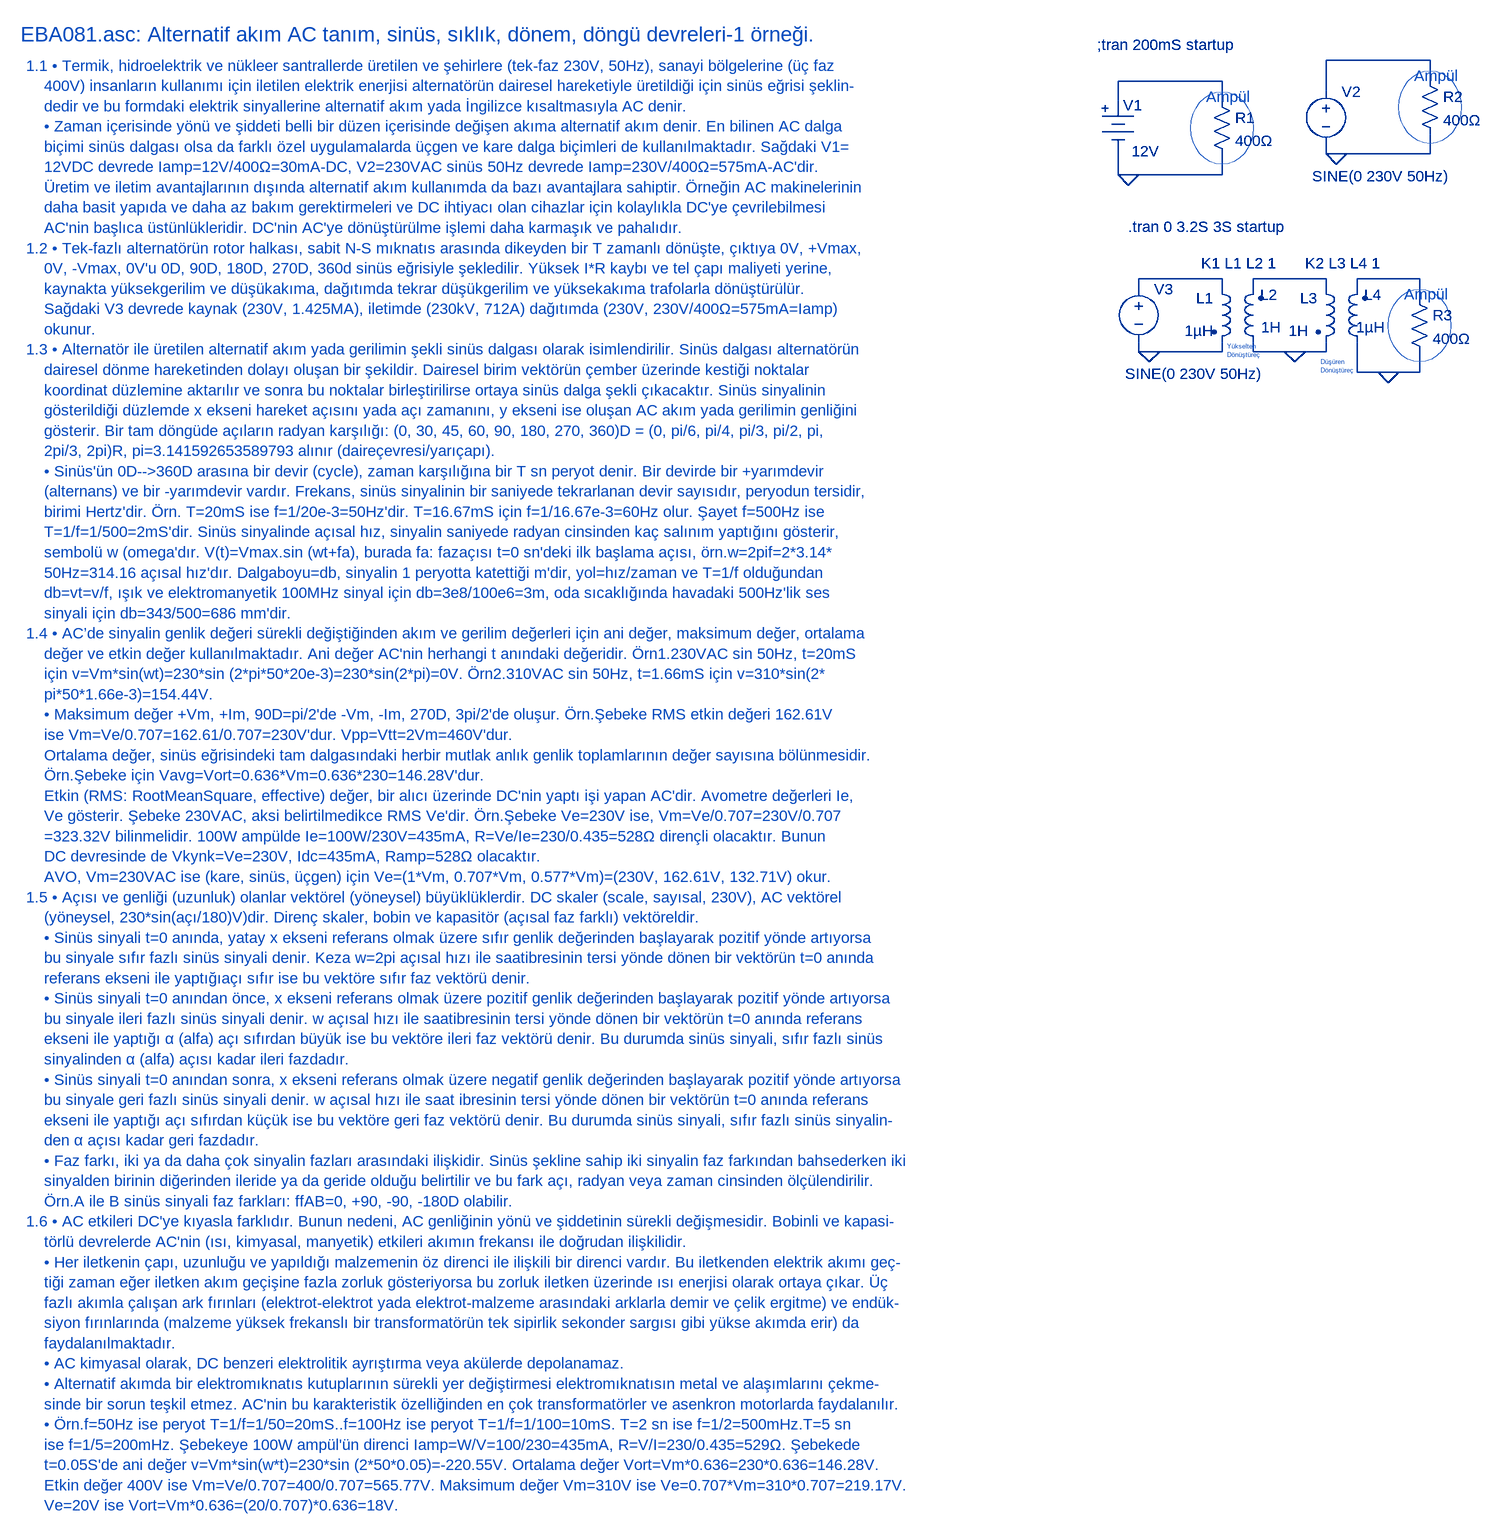
[diagram p0: schematic EBA081.asc]
EBA081.asc, the LTspice schematic file:
Version 4
SHEET 1 4076 2612
WIRE 2016 80 1856 80
WIRE 1696 112 1536 112
WIRE 2016 112 2016 80
WIRE 1856 128 1856 80
WIRE 1536 144 1536 112
WIRE 1696 144 1696 112
WIRE 1856 224 1856 208
WIRE 1872 224 1856 224
WIRE 2016 224 2016 192
WIRE 2016 224 1872 224
WIRE 1536 256 1536 224
WIRE 1552 256 1536 256
WIRE 1696 256 1696 224
WIRE 1696 256 1552 256
WIRE 1696 416 1568 416
WIRE 1856 416 1744 416
WIRE 2000 416 1904 416
WIRE 1568 432 1568 416
WIRE 1696 432 1696 416
WIRE 1744 432 1744 416
WIRE 1856 432 1856 416
WIRE 1904 432 1904 416
WIRE 2000 448 2000 416
WIRE 1568 528 1568 512
WIRE 1584 528 1568 528
WIRE 1696 528 1696 512
WIRE 1696 528 1584 528
WIRE 1744 528 1744 512
WIRE 1808 528 1744 528
WIRE 1856 528 1856 512
WIRE 1856 528 1808 528
WIRE 1904 560 1904 512
WIRE 1952 560 1904 560
WIRE 2000 560 2000 528
WIRE 2000 560 1952 560
FLAG 1552 256 0
FLAG 1872 224 0
FLAG 1584 528 0
FLAG 1808 528 0
FLAG 1952 560 0
SYMBOL Misc\\battery 1536 128 R0
WINDOW 0 8 21 Left 2
WINDOW 3 21 92 Left 2
SYMATTR InstName V1
SYMATTR Value 12V
SYMBOL res 1680 128 R0
SYMATTR InstName R1
SYMATTR Value 400Ω
SYMBOL res 2000 96 R0
SYMATTR InstName R2
SYMATTR Value 400Ω
SYMBOL voltage 1856 112 R0
WINDOW 3 -21 146 Left 2
WINDOW 123 0 0 Left 0
WINDOW 39 0 0 Left 0
SYMATTR Value SINE(0 230V 50Hz)
SYMATTR InstName V2
SYMBOL voltage 1568 416 R0
WINDOW 3 -21 146 Left 2
WINDOW 123 0 0 Left 0
WINDOW 39 0 0 Left 0
SYMATTR Value SINE(0 230V 50Hz)
SYMATTR InstName V3
SYMBOL ind2 1680 416 R0
WINDOW 0 -24 30 Left 2
WINDOW 3 -41 80 Left 2
SYMATTR InstName L1
SYMATTR Value 1µH
SYMATTR Type ind
SYMATTR SpiceLine Rser=1uΩ
SYMBOL ind2 1760 528 R180
WINDOW 0 -22 87 Left 2
WINDOW 3 -27 37 Left 2
SYMATTR InstName L2
SYMATTR Value 1H
SYMATTR Type ind
SYMBOL ind2 1840 416 R0
WINDOW 0 -24 30 Left 2
WINDOW 3 -41 80 Left 2
SYMATTR InstName L3
SYMATTR Value 1H
SYMATTR Type ind
SYMATTR SpiceLine Rser=1uΩ
SYMBOL ind2 1920 528 R180
WINDOW 0 -22 87 Left 2
WINDOW 3 -27 37 Left 2
SYMATTR InstName L4
SYMATTR Value 1µH
SYMATTR Type ind
SYMBOL res 1984 432 R0
SYMATTR InstName R3
SYMATTR Value 400Ω
TEXT -152 40 Left 3 ;EBA081.asc: Alternatif akım AC tanım, sinüs, sıklık, dönem, döngü devreleri-1 örneği.
TEXT -144 88 Left 2 ;1.1 • Termik, hidroelektrik ve nükleer santrallerde üretilen ve şehirlere (tek-faz 230V, 50Hz), sanayi bölgelerine (üç faz\n    400V) insanların kullanımı için iletilen elektrik enerjisi alternatörün dairesel hareketiyle üretildiği için sinüs eğrisi şeklin-\n    dedir ve bu formdaki elektrik sinyallerine alternatif akım yada İngilizce kısaltmasıyla AC denir.\n    • Zaman içerisinde yönü ve şiddeti belli bir düzen içerisinde değişen akıma alternatif akım denir. En bilinen AC dalga\n    biçimi sinüs dalgası olsa da farklı özel uygulamalarda üçgen ve kare dalga biçimleri de kullanılmaktadır. Sağdaki V1=\n    12VDC devrede Iamp=12V/400Ω=30mA-DC, V2=230VAC sinüs 50Hz devrede Iamp=230V/400Ω=575mA-AC'dir.\n    Üretim ve iletim avantajlarının dışında alternatif akım kullanımda da bazı avantajlara sahiptir. Örneğin AC makinelerinin\n    daha basit yapıda ve daha az bakım gerektirmeleri ve DC ihtiyacı olan cihazlar için kolaylıkla DC'ye çevrilebilmesi \n    AC'nin başlıca üstünlükleridir. DC'nin AC'ye dönüştürülme işlemi daha karmaşık ve pahalıdır.\n1.2 • Tek-fazlı alternatörün rotor halkası, sabit N-S mıknatıs arasında dikeyden bir T zamanlı dönüşte, çıktıya 0V, +Vmax,\n    0V, -Vmax, 0V'u 0D, 90D, 180D, 270D, 360d sinüs eğrisiyle şekledilir. Yüksek I*R kaybı ve tel çapı maliyeti yerine,\n    kaynakta yüksekgerilim ve düşükakıma, dağıtımda tekrar düşükgerilim ve yüksekakıma trafolarla dönüştürülür. \n    Sağdaki V3 devrede kaynak (230V, 1.425MA), iletimde (230kV, 712A) dağıtımda (230V, 230V/400Ω=575mA=Iamp)\n    okunur.\n1.3 • Alternatör ile üretilen alternatif akım yada gerilimin şekli sinüs dalgası olarak isimlendirilir. Sinüs dalgası alternatörün \n    dairesel dönme hareketinden dolayı oluşan bir şekildir. Dairesel birim vektörün çember üzerinde kestiği noktalar \n    koordinat düzlemine aktarılır ve sonra bu noktalar birleştirilirse ortaya sinüs dalga şekli çıkacaktır. Sinüs sinyalinin\n    gösterildiği düzlemde x ekseni hareket açısını yada açı zamanını, y ekseni ise oluşan AC akım yada gerilimin genliğini\n    gösterir. Bir tam döngüde açıların radyan karşılığı: (0, 30, 45, 60, 90, 180, 270, 360)D = (0, pi/6, pi/4, pi/3, pi/2, pi, \n    2pi/3, 2pi)R, pi=3.141592653589793 alınır (daireçevresi/yarıçapı).\n    • Sinüs'ün 0D-->360D arasına bir devir (cycle), zaman karşılığına bir T sn peryot denir. Bir devirde bir +yarımdevir \n    (alternans) ve bir -yarımdevir vardır. Frekans, sinüs sinyalinin bir saniyede tekrarlanan devir sayısıdır, peryodun tersidir,\n    birimi Hertz'dir. Örn. T=20mS ise f=1/20e-3=50Hz'dir. T=16.67mS için f=1/16.67e-3=60Hz olur. Şayet f=500Hz ise \n    T=1/f=1/500=2mS'dir. Sinüs sinyalinde açısal hız, sinyalin saniyede radyan cinsinden kaç salınım yaptığını gösterir,\n    sembolü w (omega'dır. V(t)=Vmax.sin (wt+fa), burada fa: fazaçısı t=0 sn'deki ilk başlama açısı, örn.w=2pif=2*3.14*\n    50Hz=314.16 açısal hız'dır. Dalgaboyu=db, sinyalin 1 peryotta katettiği m'dir, yol=hız/zaman ve T=1/f olduğundan\n    db=vt=v/f, ışık ve elektromanyetik 100MHz sinyal için db=3e8/100e6=3m, oda sıcaklığında havadaki 500Hz'lik ses\n    sinyali için db=343/500=686 mm'dir.\n1.4 • AC’de sinyalin genlik değeri sürekli değiştiğinden akım ve gerilim değerleri için ani değer, maksimum değer, ortalama\n    değer ve etkin değer kullanılmaktadır. Ani değer AC'nin herhangi t anındaki değeridir. Örn1.230VAC sin 50Hz, t=20mS\n    için v=Vm*sin(wt)=230*sin (2*pi*50*20e-3)=230*sin(2*pi)=0V. Örn2.310VAC sin 50Hz, t=1.66mS için v=310*sin(2*\n    pi*50*1.66e-3)=154.44V.\n    • Maksimum değer +Vm, +Im, 90D=pi/2'de -Vm, -Im, 270D, 3pi/2'de oluşur. Örn.Şebeke RMS etkin değeri 162.61V\n    ise Vm=Ve/0.707=162.61/0.707=230V'dur. Vpp=Vtt=2Vm=460V'dur.\n    Ortalama değer, sinüs eğrisindeki tam dalgasındaki herbir mutlak anlık genlik toplamlarının değer sayısına bölünmesidir.\n    Örn.Şebeke için Vavg=Vort=0.636*Vm=0.636*230=146.28V'dur.\n    Etkin (RMS: RootMeanSquare, effective) değer, bir alıcı üzerinde DC'nin yaptı işi yapan AC'dir. Avometre değerleri Ie,\n    Ve gösterir. Şebeke 230VAC, aksi belirtilmedikce RMS Ve'dir. Örn.Şebeke Ve=230V ise, Vm=Ve/0.707=230V/0.707\n    =323.32V bilinmelidir. 100W ampülde Ie=100W/230V=435mA, R=Ve/Ie=230/0.435=528Ω dirençli olacaktır. Bunun\n    DC devresinde de Vkynk=Ve=230V, Idc=435mA, Ramp=528Ω olacaktır.\n    AVO, Vm=230VAC ise (kare, sinüs, üçgen) için Ve=(1*Vm, 0.707*Vm, 0.577*Vm)=(230V, 162.61V, 132.71V) okur.\n1.5 • Açısı ve genliği (uzunluk) olanlar vektörel (yöneysel) büyüklüklerdir. DC skaler (scale, sayısal, 230V), AC vektörel\n    (yöneysel, 230*sin(açı/180)V)dir. Direnç skaler, bobin ve kapasitör (açısal faz farklı) vektöreldir.\n    • Sinüs sinyali t=0 anında, yatay x ekseni referans olmak üzere sıfır genlik değerinden başlayarak pozitif yönde artıyorsa\n    bu sinyale sıfır fazlı sinüs sinyali denir. Keza w=2pi açısal hızı ile saatibresinin tersi yönde dönen bir vektörün t=0 anında\n    referans ekseni ile yaptığıaçı sıfır ise bu vektöre sıfır faz vektörü denir.\n    • Sinüs sinyali t=0 anından önce, x ekseni referans olmak üzere pozitif genlik değerinden başlayarak pozitif yönde artıyorsa\n    bu sinyale ileri fazlı sinüs sinyali denir. w açısal hızı ile saatibresinin tersi yönde dönen bir vektörün t=0 anında referans\n    ekseni ile yaptığı α (alfa) açı sıfırdan büyük ise bu vektöre ileri faz vektörü denir. Bu durumda sinüs sinyali, sıfır fazlı sinüs\n    sinyalinden α (alfa) açısı kadar ileri fazdadır.\n    • Sinüs sinyali t=0 anından sonra, x ekseni referans olmak üzere negatif genlik değerinden başlayarak pozitif yönde artıyorsa\n    bu sinyale geri fazlı sinüs sinyali denir. w açısal hızı ile saat ibresinin tersi yönde dönen bir vektörün t=0 anında referans \n    ekseni ile yaptığı açı sıfırdan küçük ise bu vektöre geri faz vektörü denir. Bu durumda sinüs sinyali, sıfır fazlı sinüs sinyalin-\n    den α açısı kadar geri fazdadır.\n    • Faz farkı, iki ya da daha çok sinyalin fazları arasındaki ilişkidir. Sinüs şekline sahip iki sinyalin faz farkından bahsederken iki\n    sinyalden birinin diğerinden ileride ya da geride olduğu belirtilir ve bu fark açı, radyan veya zaman cinsinden ölçülendirilir.\n    Örn.A ile B sinüs sinyali faz farkları: ffAB=0, +90, -90, -180D olabilir.\n1.6 • AC etkileri DC'ye kıyasla farklıdır. Bunun nedeni, AC genliğinin yönü ve şiddetinin sürekli değişmesidir. Bobinli ve kapasi-\n    törlü devrelerde AC'nin (ısı, kimyasal, manyetik) etkileri akımın frekansı ile doğrudan ilişkilidir.\n    • Her iletkenin çapı, uzunluğu ve yapıldığı malzemenin öz direnci ile ilişkili bir direnci vardır. Bu iletkenden elektrik akımı geç-\n    tiği zaman eğer iletken akım geçişine fazla zorluk gösteriyorsa bu zorluk iletken üzerinde ısı enerjisi olarak ortaya çıkar. Üç \n    fazlı akımla çalışan ark fırınları (elektrot-elektrot yada elektrot-malzeme arasındaki arklarla demir ve çelik ergitme) ve endük-\n    siyon fırınlarında (malzeme yüksek frekanslı bir transformatörün tek sipirlik sekonder sargısı gibi yükse akımda erir) da \n    faydalanılmaktadır.\n    • AC kimyasal olarak, DC benzeri elektrolitik ayrıştırma veya akülerde depolanamaz.\n    • Alternatif akımda bir elektromıknatıs kutuplarının sürekli yer değiştirmesi elektromıknatısın metal ve alaşımlarını çekme-\n    sinde bir sorun teşkil etmez. AC'nin bu karakteristik özelliğinden en çok transformatörler ve asenkron motorlarda faydalanılır.\n    • Örn.f=50Hz ise peryot T=1/f=1/50=20mS..f=100Hz ise peryot T=1/f=1/100=10mS. T=2 sn ise f=1/2=500mHz.T=5 sn \n    ise f=1/5=200mHz. Şebekeye 100W ampül'ün direnci Iamp=W/V=100/230=435mA, R=V/I=230/0.435=529Ω. Şebekede\n    t=0.05S'de ani değer v=Vm*sin(w*t)=230*sin (2*50*0.05)=-220.55V. Ortalama değer Vort=Vm*0.636=230*0.636=146.28V.\n    Etkin değer 400V ise Vm=Ve/0.707=400/0.707=565.77V. Maksimum değer Vm=310V ise Ve=0.707*Vm=310*0.707=219.17V.\n    Ve=20V ise Vort=Vm*0.636=(20/0.707)*0.636=18V.
TEXT 1504 56 Left 2 !;tran 200mS startup
TEXT 1672 136 Left 2 ;Ampül
TEXT 1992 104 Left 2 ;Ampül
TEXT 1664 392 Left 2 !K1 L1 L2 1
TEXT 1824 392 Left 2 !K2 L3 L4 1
TEXT 1976 440 Left 2 ;Ampül
TEXT 1552 336 Left 2 !.tran 0 3.2S 3S startup
TEXT 1704 520 Left 0 ;Yükselten\nDönüştüreç
TEXT 1848 544 Left 0 ;Düşüren\nDönüştüreç
CIRCLE Normal 1744 240 1648 128 2
CIRCLE Normal 2064 208 1968 96 2
CIRCLE Normal 2048 544 1952 432 2

The netlist it stands for:
* EBA081.asc
V1 N002 0 12V
R1 N002 0 400Ω
R2 N001 0 400Ω
V2 N001 0 SINE(0 230V 50Hz)
V3 N003 0 SINE(0 230V 50Hz)
L1 N003 0 1µH Rser=1uΩ
L2 0 N004 1H
L3 N004 0 1H Rser=1uΩ
L4 0 N005 1µH
R3 N005 0 400Ω
* EBA081.asc: Alternatif akım AC tanım, sinüs, sıklık, dönem, döngü devreleri-1 örneği.
* 1.1 • Termik, hidroelektrik ve nükleer santrallerde üretilen ve şehirlere (tek-faz 230V, 50Hz), sanayi bölgelerine (üç faz
*     400V) insanların kullanımı için iletilen elektrik enerjisi alternatörün dairesel hareketiyle üretildiği için sinüs eğrisi şeklin-
*     dedir ve bu formdaki elektrik sinyallerine alternatif akım yada İngilizce kısaltmasıyla AC denir.
*     • Zaman içerisinde yönü ve şiddeti belli bir düzen içerisinde değişen akıma alternatif akım denir. En bilinen AC dalga
*     biçimi sinüs dalgası olsa da farklı özel uygulamalarda üçgen ve kare dalga biçimleri de kullanılmaktadır. Sağdaki V1=
*     12VDC devrede Iamp=12V/400Ω=30mA-DC, V2=230VAC sinüs 50Hz devrede Iamp=230V/400Ω=575mA-AC'dir.
*     Üretim ve iletim avantajlarının dışında alternatif akım kullanımda da bazı avantajlara sahiptir. Örneğin AC makinelerinin
*     daha basit yapıda ve daha az bakım gerektirmeleri ve DC ihtiyacı olan cihazlar için kolaylıkla DC'ye çevrilebilmesi
*     AC'nin başlıca üstünlükleridir. DC'nin AC'ye dönüştürülme işlemi daha karmaşık ve pahalıdır.
* 1.2 • Tek-fazlı alternatörün rotor halkası, sabit N-S mıknatıs arasında dikeyden bir T zamanlı dönüşte, çıktıya 0V, +Vmax,
*     0V, -Vmax, 0V'u 0D, 90D, 180D, 270D, 360d sinüs eğrisiyle şekledilir. Yüksek I*R kaybı ve tel çapı maliyeti yerine,
*     kaynakta yüksekgerilim ve düşükakıma, dağıtımda tekrar düşükgerilim ve yüksekakıma trafolarla dönüştürülür.
*     Sağdaki V3 devrede kaynak (230V, 1.425MA), iletimde (230kV, 712A) dağıtımda (230V, 230V/400Ω=575mA=Iamp)
*     okunur.
* 1.3 • Alternatör ile üretilen alternatif akım yada gerilimin şekli sinüs dalgası olarak isimlendirilir. Sinüs dalgası alternatörün
*     dairesel dönme hareketinden dolayı oluşan bir şekildir. Dairesel birim vektörün çember üzerinde kestiği noktalar
*     koordinat düzlemine aktarılır ve sonra bu noktalar birleştirilirse ortaya sinüs dalga şekli çıkacaktır. Sinüs sinyalinin
*     gösterildiği düzlemde x ekseni hareket açısını yada açı zamanını, y ekseni ise oluşan AC akım yada gerilimin genliğini
*     gösterir. Bir tam döngüde açıların radyan karşılığı: (0, 30, 45, 60, 90, 180, 270, 360)D = (0, pi/6, pi/4, pi/3, pi/2, pi,
*     2pi/3, 2pi)R, pi=3.141592653589793 alınır (daireçevresi/yarıçapı).
*     • Sinüs'ün 0D-->360D arasına bir devir (cycle), zaman karşılığına bir T sn peryot denir. Bir devirde bir +yarımdevir
*     (alternans) ve bir -yarımdevir vardır. Frekans, sinüs sinyalinin bir saniyede tekrarlanan devir sayısıdır, peryodun tersidir,
*     birimi Hertz'dir. Örn. T=20mS ise f=1/20e-3=50Hz'dir. T=16.67mS için f=1/16.67e-3=60Hz olur. Şayet f=500Hz ise
*     T=1/f=1/500=2mS'dir. Sinüs sinyalinde açısal hız, sinyalin saniyede radyan cinsinden kaç salınım yaptığını gösterir,
*     sembolü w (omega'dır. V(t)=Vmax.sin (wt+fa), burada fa: fazaçısı t=0 sn'deki ilk başlama açısı, örn.w=2pif=2*3.14*
*     50Hz=314.16 açısal hız'dır. Dalgaboyu=db, sinyalin 1 peryotta katettiği m'dir, yol=hız/zaman ve T=1/f olduğundan
*     db=vt=v/f, ışık ve elektromanyetik 100MHz sinyal için db=3e8/100e6=3m, oda sıcaklığında havadaki 500Hz'lik ses
*     sinyali için db=343/500=686 mm'dir.
* 1.4 • AC’de sinyalin genlik değeri sürekli değiştiğinden akım ve gerilim değerleri için ani değer, maksimum değer, ortalama
*     değer ve etkin değer kullanılmaktadır. Ani değer AC'nin herhangi t anındaki değeridir. Örn1.230VAC sin 50Hz, t=20mS
*     için v=Vm*sin(wt)=230*sin (2*pi*50*20e-3)=230*sin(2*pi)=0V. Örn2.310VAC sin 50Hz, t=1.66mS için v=310*sin(2*
*     pi*50*1.66e-3)=154.44V.
*     • Maksimum değer +Vm, +Im, 90D=pi/2'de -Vm, -Im, 270D, 3pi/2'de oluşur. Örn.Şebeke RMS etkin değeri 162.61V
*     ise Vm=Ve/0.707=162.61/0.707=230V'dur. Vpp=Vtt=2Vm=460V'dur.
*     Ortalama değer, sinüs eğrisindeki tam dalgasındaki herbir mutlak anlık genlik toplamlarının değer sayısına bölünmesidir.
*     Örn.Şebeke için Vavg=Vort=0.636*Vm=0.636*230=146.28V'dur.
*     Etkin (RMS: RootMeanSquare, effective) değer, bir alıcı üzerinde DC'nin yaptı işi yapan AC'dir. Avometre değerleri Ie,
*     Ve gösterir. Şebeke 230VAC, aksi belirtilmedikce RMS Ve'dir. Örn.Şebeke Ve=230V ise, Vm=Ve/0.707=230V/0.707
*     =323.32V bilinmelidir. 100W ampülde Ie=100W/230V=435mA, R=Ve/Ie=230/0.435=528Ω dirençli olacaktır. Bunun
*     DC devresinde de Vkynk=Ve=230V, Idc=435mA, Ramp=528Ω olacaktır.
*     AVO, Vm=230VAC ise (kare, sinüs, üçgen) için Ve=(1*Vm, 0.707*Vm, 0.577*Vm)=(230V, 162.61V, 132.71V) okur.
* 1.5 • Açısı ve genliği (uzunluk) olanlar vektörel (yöneysel) büyüklüklerdir. DC skaler (scale, sayısal, 230V), AC vektörel
*     (yöneysel, 230*sin(açı/180)V)dir. Direnç skaler, bobin ve kapasitör (açısal faz farklı) vektöreldir.
*     • Sinüs sinyali t=0 anında, yatay x ekseni referans olmak üzere sıfır genlik değerinden başlayarak pozitif yönde artıyorsa
*     bu sinyale sıfır fazlı sinüs sinyali denir. Keza w=2pi açısal hızı ile saatibresinin tersi yönde dönen bir vektörün t=0 anında
*     referans ekseni ile yaptığıaçı sıfır ise bu vektöre sıfır faz vektörü denir.
*     • Sinüs sinyali t=0 anından önce, x ekseni referans olmak üzere pozitif genlik değerinden başlayarak pozitif yönde artıyorsa
*     bu sinyale ileri fazlı sinüs sinyali denir. w açısal hızı ile saatibresinin tersi yönde dönen bir vektörün t=0 anında referans
*     ekseni ile yaptığı α (alfa) açı sıfırdan büyük ise bu vektöre ileri faz vektörü denir. Bu durumda sinüs sinyali, sıfır fazlı sinüs
*     sinyalinden α (alfa) açısı kadar ileri fazdadır.
*     • Sinüs sinyali t=0 anından sonra, x ekseni referans olmak üzere negatif genlik değerinden başlayarak pozitif yönde artıyorsa
*     bu sinyale geri fazlı sinüs sinyali denir. w açısal hızı ile saat ibresinin tersi yönde dönen bir vektörün t=0 anında referans
*     ekseni ile yaptığı açı sıfırdan küçük ise bu vektöre geri faz vektörü denir. Bu durumda sinüs sinyali, sıfır fazlı sinüs sinyalin-
*     den α açısı kadar geri fazdadır.
*     • Faz farkı, iki ya da daha çok sinyalin fazları arasındaki ilişkidir. Sinüs şekline sahip iki sinyalin faz farkından bahsederken iki
*     sinyalden birinin diğerinden ileride ya da geride olduğu belirtilir ve bu fark açı, radyan veya zaman cinsinden ölçülendirilir.
*     Örn.A ile B sinüs sinyali faz farkları: ffAB=0, +90, -90, -180D olabilir.
* 1.6 • AC etkileri DC'ye kıyasla farklıdır. Bunun nedeni, AC genliğinin yönü ve şiddetinin sürekli değişmesidir. Bobinli ve kapasi-
*     törlü devrelerde AC'nin (ısı, kimyasal, manyetik) etkileri akımın frekansı ile doğrudan ilişkilidir.
*     • Her iletkenin çapı, uzunluğu ve yapıldığı malzemenin öz direnci ile ilişkili bir direnci vardır. Bu iletkenden elektrik akımı geç-
*     tiği zaman eğer iletken akım geçişine fazla zorluk gösteriyorsa bu zorluk iletken üzerinde ısı enerjisi olarak ortaya çıkar. Üç
*     fazlı akımla çalışan ark fırınları (elektrot-elektrot yada elektrot-malzeme arasındaki arklarla demir ve çelik ergitme) ve endük-
*     siyon fırınlarında (malzeme yüksek frekanslı bir transformatörün tek sipirlik sekonder sargısı gibi yükse akımda erir) da
*     faydalanılmaktadır.
*     • AC kimyasal olarak, DC benzeri elektrolitik ayrıştırma veya akülerde depolanamaz.
*     • Alternatif akımda bir elektromıknatıs kutuplarının sürekli yer değiştirmesi elektromıknatısın metal ve alaşımlarını çekme-
*     sinde bir sorun teşkil etmez. AC'nin bu karakteristik özelliğinden en çok transformatörler ve asenkron motorlarda faydalanılır.
*     • Örn.f=50Hz ise peryot T=1/f=1/50=20mS..f=100Hz ise peryot T=1/f=1/100=10mS. T=2 sn ise f=1/2=500mHz.T=5 sn
*     ise f=1/5=200mHz. Şebekeye 100W ampül'ün direnci Iamp=W/V=100/230=435mA, R=V/I=230/0.435=529Ω. Şebekede
*     t=0.05S'de ani değer v=Vm*sin(w*t)=230*sin (2*50*0.05)=-220.55V. Ortalama değer Vort=Vm*0.636=230*0.636=146.28V.
*     Etkin değer 400V ise Vm=Ve/0.707=400/0.707=565.77V. Maksimum değer Vm=310V ise Ve=0.707*Vm=310*0.707=219.17V.
*     Ve=20V ise Vort=Vm*0.636=(20/0.707)*0.636=18V.
;tran 200mS startup
* Ampül
* Ampül
K1 L1 L2 1
K2 L3 L4 1
* Ampül
.tran 0 3.2S 3S startup
* Yükselten
* Dönüştüreç
* Düşüren
* Dönüştüreç
.backanno
.end